# Altium schematic sheet Power Supply and Connector.SchDoc
size A4; SheetNumber: 2; SheetTotal: 4
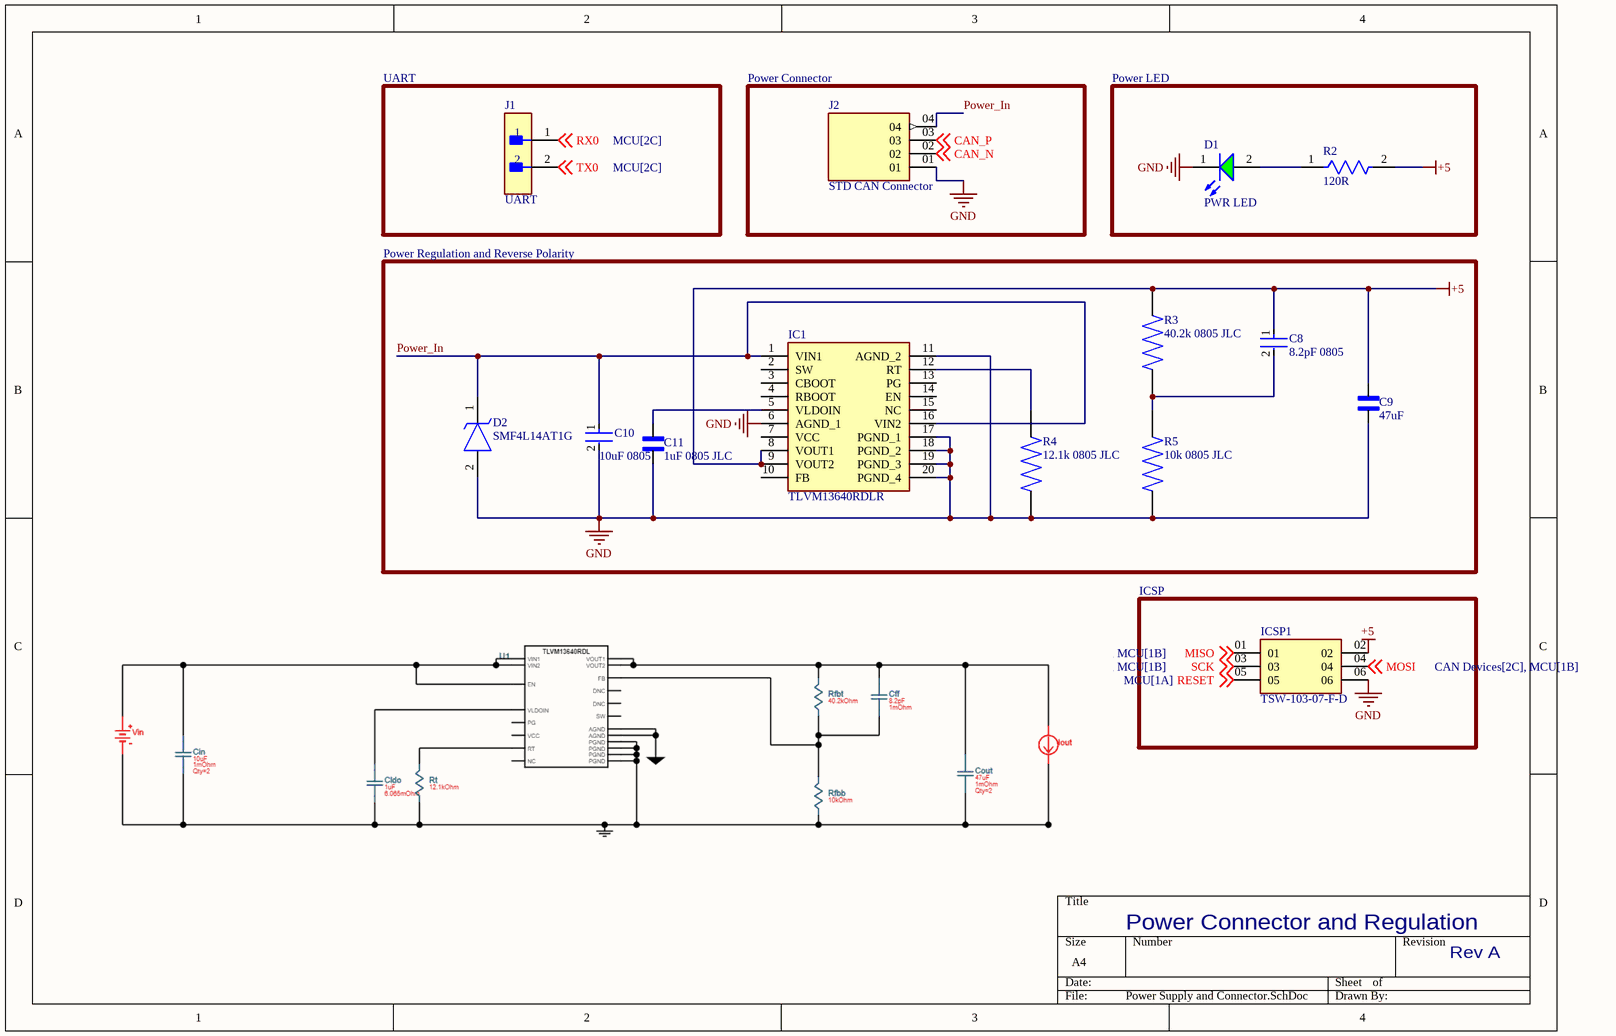
[diagram p0: Power Supply and Connector.SchDoc]

## Parts
C8  8.2pF 0805  [FP-GQM219-0_15-IPC_C]
C9  47uF  [CAPC3216X160N]
C10  10uF 0805  [FP-GRM21B-0_2-e0_2_0_7-IPC_A]
C11  1uF 0805 JLC  [CAPC2012X140N]
D1  PWR LED  [WL-SMCW_0805_150080xx75000]
D2  SMF4L14AT1G  [SODFL3619X98N]
IC1  TLVM13640RDLR  [TLVM13640RDLR]
ICSP1  TSW-103-07-F-D  [SAMTEC_TSW-103-07-F-D]
J1  UART  [FP-TSW-102-07-F-S-MFG]
J2  STD CAN Connector  [SAMTEC_TSW-104-07-F-S]
R2  120R  [FP-CRCW0805-e3-IPC_C]
R3  40.2k 0805 JLC  [RESC2012X65N]
R4  12.1k 0805 JLC  [RESC2012X65N]
R5  10k 0805 JLC  [RESC2012X65N]

## Blocks framed on the sheet
UART: J1
Power Connector: J2
Power LED: D1 R2
Power Regulation and Reverse Polarity: C8-C11 D2 IC1 R3-R5
ICSP: ICSP1

## Nets
+5: C8.1 C9.2 IC1.8(VOUT1) IC1.9(VOUT2) ICSP1.02 R2.2 R3.2
GND: C9.1 C10.2 C11.2 D1.1(K) D2.2(A) IC1.6(AGND_1) IC1.11(AGND_2) IC1.17(PGND_1) IC1.18(PGND_2) IC1.19(PGND_3) IC1.20(PGND_4) ICSP1.06 J2.01 R4.1 R5.1
CAN_N: J2.02 ; off-sheet CAN_N
CAN_P: J2.03 ; off-sheet CAN_P
MISO: ICSP1.01 ; off-sheet MISO
MOSI: ICSP1.04 ; off-sheet MOSI
Power_In: C10.1 D2.1(K) IC1.1(VIN1) IC1.16(VIN2) J2.04
RESET: ICSP1.05 ; off-sheet RESET
RX0: J1.1 ; off-sheet RX0
SCK: ICSP1.03 ; off-sheet SCK
TX0: J1.2 ; off-sheet TX0
NetC8_2: C8.2 R3.1 R5.2
NetC11_1: C11.1 IC1.5(VLDOIN)
NetD1_2: D1.2(A) R2.1
NetIC1_12: IC1.12(RT) R4.2

Not connected (* = marked no-connect by the designer): IC1 2(SW) 3(CBOOT) 4(RBOOT) 7(VCC) 10(FB) 13(PG) 14(EN) 15(NC)

## Notes on the sheet
- Power Connector and Regulation
- Rev A

## Library data of the parts
C8 = CMP-2007-03761-2: Ceramic Capacitor 8.2pF ±0.25pF 250VDC C0G 0805 Paper T/R; Voltage Rating (DC): 250V; Package Quantity: 1; Max Operating Temperature: 125°C; Mount: Surface Mount; Thickness: 0.039inch; Dielectric: C0G; Capacitance: 8.2pF; Case Code (Imperial): 0805; Case/Package: 0805; Min Operating Temperature: -55°C; Depth: 1.25mm; Case Code (Metric): 2012; Width: 0.049inch; Packaging: Tape and Reel; Radiation Hardening: No; Height: 0.85mm; Voltage Rating: 250V; Termination: SMD/SMT; Length: 2mm
C9 = GRM31CR61E476ME44K: MF: {'manufacturer': u'Murata Electronics'}; Package: None; Price: None; Value: *; MP: GRM31CR61E476ME44K; Availability: Unavailable
C10 = CMP-06035-004402-1: Chip Multilayer Ceramic Capacitors for General Purpose, 0805, 10uF, X5R, 15%, 10%, 50V; Voltage Rating (DC): 50V; Dielectric: X5R; Tolerance: 10%; Capacitance: 10uF; Thickness: 1.25mm; Length: 2mm; Width: 1.25mm
C11 = CL21B105KBFNNNE: Capacitor: ceramic; MLCC; 1uF; 50V; X7R; Â±10%; SMD; 0805; MF: {'manufacturer': u'Samsung Electro-Mechanics'}; Package: None; Price: None; Value: *; MP: CL21B105KBFNNNE; Availability: Unavailable
D1 = CMP-1426-00007-3: WURTH ELEKTRONIK - 150080GS75000 - LED, Green, SMD, 0805, 30 mA, 3.2 V, 520 nm; Forward Voltage: 3.2V; Viewing Angle: 140°; Power Dissipation: 105mW; Peak Wavelength: 515nm; Max Reverse Voltage (DC): 5V; Luminous Intensity: 450mcd; Wavelength: 525nm; Max Junction Temperature (Tj): 95°C; Forward Current: 100mA; Test Current: 20mA; Lens Style: Clear, Rectangular; Length: 2mm; Case/Package: 0805; Case Code (Metric): 2012; Color: Green; Height: 700µm; Width: 1.25mm; Packaging: Tape and Reel; Mount: Surface Mount; REACH SVHC: Unknown; RoHS: Compliant; Min Operating Temperature: -40°C; Reverse Voltage: 5V; Max Operating Temperature: 85°C; Dominant Wavelength: 525nm; Case Code (Imperial): 0805
D2 = SMF4L14AT1G: TVS Diode (Uni-directional); Manufacturer_Name: LITTELFUSE; Datasheet Link: https://www.littelfuse.com/media?resourcetype=datasheets&itemid=f093622a-2591-4e70-85e6-32321d2f8c5a&filename=tvs-diode-smf4l-t1g-datasheet; Height: 0.98mm; Manufacturer_Part_Number: SMF4L14AT1G; Mouser Part Number: 576-SMF4L14AT1G; Mouser Price/Stock: https://www.mouser.co.uk/ProductDetail/Littelfuse/SMF4L14AT1G?qs=OcgtsXO%252B3gvCCebw4hBNNg%3D%3D
IC1 = TLVM13640RDLR: Integrated Circuit; Manufacturer_Name: Texas Instruments; Datasheet Link: https://www.ti.com/lit/ds/symlink/tlvm13640.pdf?ts=1714956193865; Height: 4.1mm; Manufacturer_Part_Number: TLVM13640RDLR; Mouser Part Number: 595-TLVM13640RDLR; Mouser Price/Stock: https://www.mouser.co.uk/ProductDetail/Texas-Instruments/TLVM13640RDLR?qs=t7xnP681wgVr%2F1xCMRui%2FQ%3D%3D; Arrow Part Number: TLVM13640RDLR; Arrow Price/Stock: null?utm_currency=USD&region=nac
ICSP1 = TSW-103-07-F-D: MF: {'manufacturer': u'Samtec'}; Package: None; Price: None; Value: *; MP: TSW-103-07-F-D; Availability: Unavailable
J1 = CMP-02766-001458-1: CONN HEADER VERT 2POS 2.54MM; Gender: Male; Max Current Rating: 7.6A; Number of Contacts: 2; Max Voltage Rating (AC): 550V; Orientation: Straight; Depth: 2.54mm; Series: TSW; Package Quantity: 1; Min Operating Temperature: -55°C; Max Operating Temperature: 125°C; Contact Type: Male Pin; Contact Shape: Square; Color: Black; Housing Color: Black; Connector Type: Header; Fastening Type: Pull; Radiation Hardening: No; Pitch: 2.54mm; Housing Material: Polyester; Mount: Through Hole; Number of Positions: 2; Number of Rows: 1; Contact Material: Bronze; Insulation Color: Black; Contact Finish - Mating: GOLD; Termination: Solder; Insulation Material: PBT; Length: 5.08mm; Flammability Rating: UL94 V-0; Contact Mating Length: 0.23inch; REACH SVHC: No SVHC; Contact Plating: Gold; RoHS Compliant: Yes; Packaging: Bulk
J2 = TSW-104-07-F-S: MF: {'manufacturer': u'Samtec'}; Package: None; Price: None; Value: *; MP: TSW-104-07-F-S; Availability: Unavailable
R2 = CMP-02407-007854-1: RES Thick Film, 120Ω, 1%, 0.125W, 100ppm/°C, 0805; Voltage Rating (DC): 150V; Max Power Dissipation: 125mW; Height: 0.45mm; Min Operating Temperature: -55°C; Packaging: Tape and Reel; Resistance: 120R; Package Quantity: 10; Width: 1.25mm; Weight: 0.000194oz; Termination: SMD/SMT; Mount: Surface Mount; Tolerance: 1%; Military Standard: Not; Max Operating Temperature: 155°C; Lead Free: Lead Free; Number of Terminations: 2; Radiation Hardening: No; Temperature Coefficient: 100ppm/°C; Length: 2mm; Case/Package: 0805; Voltage Rating: 150V; Case Code (Metric): 2012; Case Code (Imperial): 0805; Features: Automotive AEC-Q200; Composition: Thick Film; Contact Plating: Tin; Power Rating: 125mW; Depth: 1.25mm
R3 = 0805W8F4022T5E: MF: {'manufacturer': u'Uni-Royal'}; Package: None; Price: None; Value: *; MP: 0805W8F4022T5E; Availability: Unavailable
R4 = 0805W8F1212T5E: MF: {'manufacturer': u'Uni-Royal'}; Package: None; Price: None; Value: *; MP: 0805W8F1212T5E; Availability: Unavailable
R5 = 0805W8F1002T5E: MF: {'manufacturer': u'Uni-Royal'}; Package: None; Price: None; Value: *; MP: 0805W8F1002T5E; Availability: Unavailable